# EAGLE schematic octanis_eps_mcu_shdn (EAGLE 7.1.0)
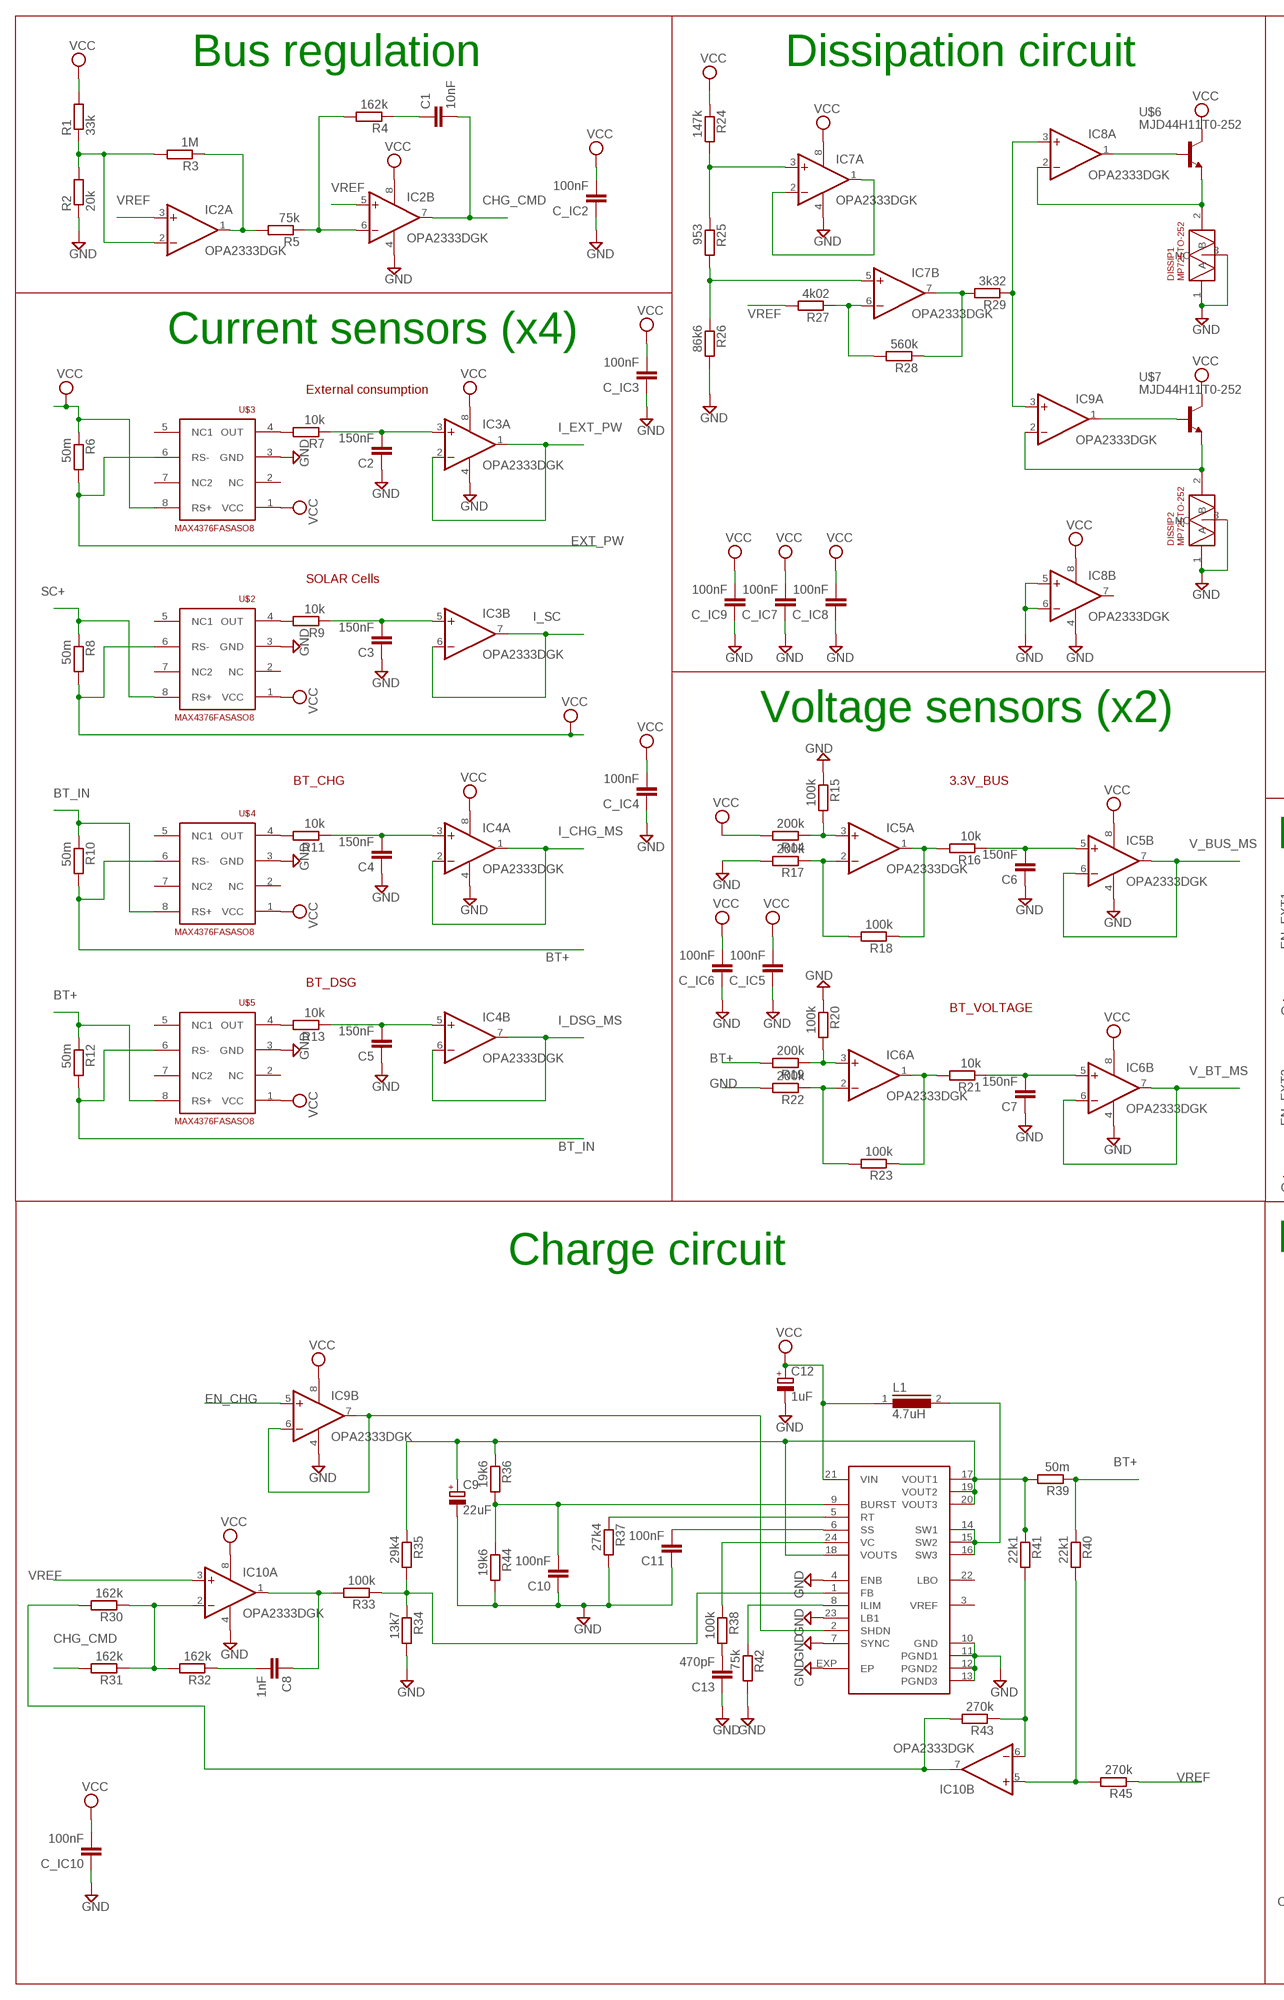
[diagram p0: schematic, sheet 1, part 1 of 2]
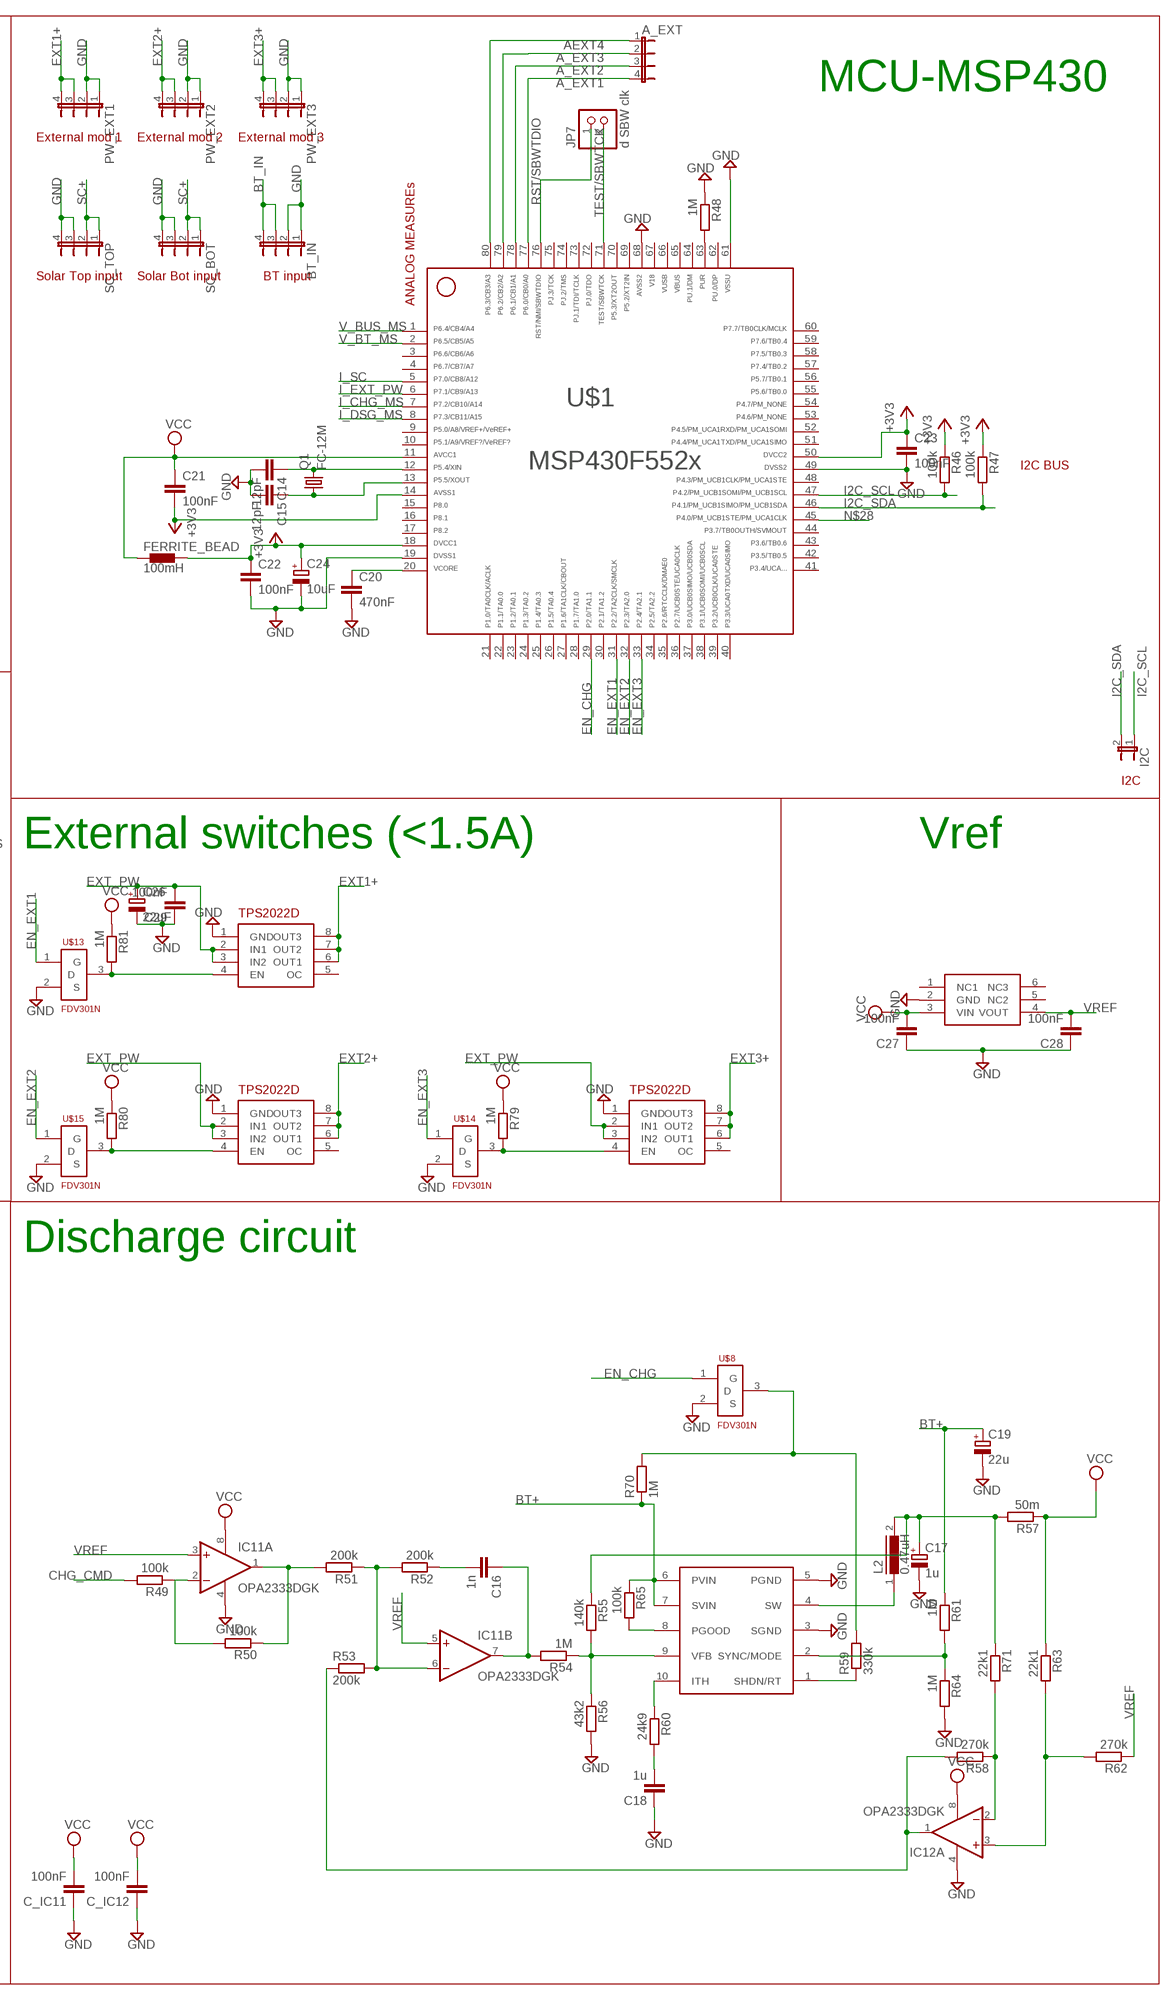
[diagram p1: schematic, sheet 1, part 2 of 2]

## Parts
A_EXT  JP4E  [JP4]
BT_IN  JP4E  [JP4]
C1  10nF  C-EUC0603  [C0603]
C2  150nF  C-EUC0603  [C0603]
C3  150nF  C-EUC0603  [C0603]
C4  150nF  C-EUC0603  [C0603]
C5  150nF  C-EUC0603  [C0603]
C6  150nF  C-EUC0603  [C0603]
C7  150nF  C-EUC0603  [C0603]
C8  1nF  C-EUC0603  [C0603]
C9  22uF  CPOL-EUA/3216-18R  [A/3216-18R]
C10  100nF  C-EUC0603  [C0603]
C11  100nF  C-EUC0603  [C0603]
C12  1uF  CPOL-EUA/3216-18R  [A/3216-18R]
C13  470pF  C-EUC0603  [C0603]
C14  12pF  C-EUC0603  [C0603]
C15  12pF  C-EUC0603  [C0603]
C16  1n  C-EUC0603  [C0603]
C17  1u  CPOL-EUA/3216-18R  [A/3216-18R]
C18  1u  C-EUC0603  [C0603]
C19  22u  CPOL-EUA/3216-18R  [A/3216-18R]
C20  470nF  C-EUC0603  [C0603]
C21  100nF  C-EUC0603  [C0603]
C22  100nF  C-EUC0603  [C0603]
C23  100nF  C-EUC0603  [C0603]
C24  10uF  CPOL-EUA/3216-18R  [A/3216-18R]
C26  22uF  CPOL-EUA/3216-18R  [A/3216-18R]
C27  100nF  C-EUC0603  [C0603]
C28  100nF  C-EUC0603  [C0603]
C29  100nF  C-EUC0603  [C0603]
C_IC2  100nF  C-EUC0603  [C0603]
C_IC3  100nF  C-EUC0603  [C0603]
C_IC4  100nF  C-EUC0603  [C0603]
C_IC5  100nF  C-EUC0603  [C0603]
C_IC6  100nF  C-EUC0603  [C0603]
C_IC7  100nF  C-EUC0603  [C0603]
C_IC8  100nF  C-EUC0603  [C0603]
C_IC9  100nF  C-EUC0603  [C0603]
C_IC10  100nF  C-EUC0603  [C0603]
C_IC11  100nF  C-EUC0603  [C0603]
C_IC12  100nF  C-EUC0603  [C0603]
DISSIP1  MP725TO-252  [TO252]
DISSIP2  MP725TO-252  [TO252]
FERRITE_BEAD  100mH  BLM15HD601SN1  [0402]
I2C  JP1E  [JP1]
IC2  OPA2333DGK  [MSOP08]
IC3  OPA2333DGK  [MSOP08]
IC4  OPA2333DGK  [MSOP08]
IC5  OPA2333DGK  [MSOP08]
IC6  OPA2333DGK  [MSOP08]
IC7  OPA2333DGK  [MSOP08]
IC8  OPA2333DGK  [MSOP08]
IC9  OPA2333DGK  [MSOP08]
IC10  OPA2333DGK  [MSOP08]
IC11  OPA2333DGK  [MSOP08]
IC12  OPA2333DGK  [MSOP08]
JP7  d SBW clk  PINHD-1X2  [1X02]
L1  4.7uH  DR73  [DR73]
L2  0.47uH  DR73  [DR73]
LTC3411  LT3411  [MSOP10]
PW_EXT1  JP4E  [JP4]
PW_EXT2  JP4E  [JP4]
PW_EXT3  JP4E  [JP4]
Q1  FC-12M  [FC-12M]
R1  33k  R-EU_R0603  [R0603]
R2  20k  R-EU_R0603  [R0603]
R3  1M  R-EU_R0603  [R0603]
R4  162k  R-EU_R0603  [R0603]
R5  75k  R-EU_R0603  [R0603]
R6  50m  R-EU_R1206  [R1206]
R7  10k  R-EU_R0603  [R0603]
R8  50m  R-EU_R1206  [R1206]
R9  10k  R-EU_R0603  [R0603]
R10  50m  R-EU_R1206  [R1206]
R11  10k  R-EU_R0603  [R0603]
R12  50m  R-EU_R1206  [R1206]
R13  10k  R-EU_R0603  [R0603]
R14  200k  R-EU_R0603  [R0603]
R15  100k  R-EU_R0603  [R0603]
R16  10k  R-EU_R0603  [R0603]
R17  200k  R-EU_R0603  [R0603]
R18  100k  R-EU_R0603  [R0603]
R19  200k  R-EU_R0603  [R0603]
R20  100k  R-EU_R0603  [R0603]
R21  10k  R-EU_R0603  [R0603]
R22  200k  R-EU_R0603  [R0603]
R23  100k  R-EU_R0603  [R0603]
R24  147k  R-EU_R0603  [R0603]
R25  953  R-EU_R0603  [R0603]
R26  86k6  R-EU_R0603  [R0603]
R27  4k02  R-EU_R0603  [R0603]
R28  560k  R-EU_R0603  [R0603]
R29  3k32  R-EU_R0603  [R0603]
R30  162k  R-EU_R0603  [R0603]
R31  162k  R-EU_R0603  [R0603]
R32  162k  R-EU_R0603  [R0603]
R33  100k  R-EU_R0603  [R0603]
R34  13k7  R-EU_R0603  [R0603]
R35  29k4  R-EU_R0603  [R0603]
R36  19k6  R-EU_R0603  [R0603]
R37  27k4  R-EU_R0603  [R0603]
R38  100k  R-EU_R0603  [R0603]
R39  50m  R-EU_R1206  [R1206]
R40  22k1  R-EU_R0603  [R0603]
R41  22k1  R-EU_R0603  [R0603]
R42  75k  R-EU_R0603  [R0603]
R43  270k  R-EU_R0603  [R0603]
R44  19k6  R-EU_R0603  [R0603]
R45  270k  R-EU_R0603  [R0603]
R46  100k  R-EU_R0603  [R0603]
R47  100k  R-EU_R0603  [R0603]
R48  1M  R-EU_R0603  [R0603]
R49  100k  R-EU_R0603  [R0603]
R50  100k  R-EU_R0603  [R0603]
R51  200k  R-EU_R0603  [R0603]
R52  200k  R-EU_R0603  [R0603]
R53  200k  R-EU_R0603  [R0603]
R54  1M  R-EU_R0603  [R0603]
R55  140k  R-EU_R0603  [R0603]
R56  43k2  R-EU_R0603  [R0603]
R57  50m  R-EU_R1206  [R1206]
R58  270k  R-EU_R0603  [R0603]
R59  330k  R-EU_R0603  [R0603]
R60  24k9  R-EU_R0603  [R0603]
R61  1M  R-EU_R0603  [R0603]
R62  270k  R-EU_R0603  [R0603]
R63  22k1  R-EU_R0603  [R0603]
R64  1M  R-EU_R0603  [R0603]
R65  100k  R-EU_R0603  [R0603]
R70  1M  R-EU_R0603  [R0603]
R71  22k1  R-EU_R0603  [R0603]
R79  1M  R-EU_R0603  [R0603]
R80  1M  R-EU_R0603  [R0603]
R81  1M  R-EU_R0603  [R0603]
SC_BOT  JP4E  [JP4]
SC_TOP  JP4E  [JP4]
U$1  F552X---PN80  [PN80]
U$2  MAX4376FASASO8  [SO8]
U$3  MAX4376FASASO8  [SO8]
U$4  MAX4376FASASO8  [SO8]
U$5  MAX4376FASASO8  [SO8]
U$6  MJD44H11T0-252  [TO252]
U$7  MJD44H11T0-252  [TO252]
U$8  FDV301N  [SOT23]
U$11  LTC3421  [QFN24]
U$13  FDV301N  [SOT23]
U$14  FDV301N  [SOT23]
U$15  FDV301N  [SOT23]
U$16  TPS2022D  [SO8]
U$17  TPS2022D  [SO8]
U$18  TPS2022D  [SO8]
U$19  ADR127B  [TSOT23-6]

## Nets
+3V3: C21.2 C22.1 C23.1 C24.+ FERRITE_BEAD.2 R46.1 R47.1 U$1.14 U$1.18 U$1.50
A_EXT1: A_EXT.4 U$1.77
A_EXT2: A_EXT.3 U$1.78
A_EXT3: A_EXT.2 U$1.79
AEXT4: A_EXT.1 U$1.80
BT+: C19.+ LTC3411.6(PVIN) LTC3411.7(SVIN) R10.2 R12.1 R19.2 R39.1 R40.1 R61.1 R65.1 R70.1 U$4.6(RS-) U$5.8(RS+)
BT_IN: BT_IN.3 BT_IN.4 R10.1 R12.2 U$4.8(RS+) U$5.6(RS-)
CHG_CMD: C1.2 IC2.7(B:OUT) R31.2 R49.2
EN_CHG: IC9.5(B:+IN) U$1.29 U$8.1(G)
EN_EXT1: U$1.31 U$13.1(G)
EN_EXT2: U$1.32 U$15.1(G)
EN_EXT3: U$1.33 U$14.1(G)
EXT1+: PW_EXT1.3 PW_EXT1.4 U$16.6(OUT1) U$16.7(OUT2) U$16.8(OUT3)
EXT2+: PW_EXT2.3 PW_EXT2.4 U$17.6(OUT1) U$17.7(OUT2) U$17.8(OUT3)
EXT3+: PW_EXT3.3 PW_EXT3.4 U$18.6(OUT1) U$18.7(OUT2) U$18.8(OUT3)
EXT_PW: C26.+ C29.2 R6.2 U$3.6(RS-) U$16.2(IN1) U$16.3(IN2) U$17.2(IN1) U$17.3(IN2) U$18.2(IN1) U$18.3(IN2)
GND: BT_IN.1 BT_IN.2 C2.1 C3.1 C4.1 C5.1 C6.1 C7.1 C9.- C10.1 C11.1 C12.- C13.1 C14.2 C15.2 C17.- C18.1 C19.- C20.2 C22.2 C23.2 C24.- C26.- C27.1 C28.1 C29.1 C_IC2.1 C_IC3.1 C_IC4.1 C_IC5.1 C_IC6.1 C_IC7.1 C_IC8.1 C_IC9.1 C_IC10.1 C_IC11.1 C_IC12.1 DISSIP1.1(A) DISSIP1.3(NC) DISSIP2.1(A) DISSIP2.3(NC) IC2.4(P:V-) IC3.4(P:V-) IC4.4(P:V-) IC5.4(P:V-) IC6.4(P:V-) IC7.4(P:V-) IC8.4(P:V-) IC8.5(B:+IN) IC8.6(B:-IN) IC9.4(P:V-) IC10.4(P:V-) IC11.4(P:V-) IC12.4(P:V-) LTC3411.3(SGND) LTC3411.5(PGND) PW_EXT1.1 PW_EXT1.2 PW_EXT2.1 PW_EXT2.2 PW_EXT3.1 PW_EXT3.2 R2.1 R15.1 R17.2 R20.1 R22.2 R26.2 R34.2 R37.2 R42.2 R44.2 R48.1 R56.2 R64.2 SC_BOT.3 SC_BOT.4 SC_TOP.3 SC_TOP.4 U$1.19 U$1.49 U$1.61 U$1.68 U$2.3(GND) U$3.3(GND) U$4.3(GND) U$5.3(GND) U$8.2(S) U$11.4(ENB) U$11.7(SYNC) U$11.10(GND) U$11.11(PGND1) U$11.12(PGND2) U$11.13(PGND3) U$11.23(LB1) U$11.EXP(EP) U$13.2(S) U$14.2(S) U$15.2(S) U$16.1(GND) U$17.1(GND) U$18.1(GND) U$19.2(GND)
I2C_SCL: I2C.1 R46.2 U$1.47
I2C_SDA: I2C.2 R47.2 U$1.46
I_CHG_MS: IC4.1(A:OUT) IC4.2(A:-IN) U$1.7
I_DSG_MS: IC4.6(B:-IN) IC4.7(B:OUT) U$1.8
I_EXT_PW: IC3.1(A:OUT) IC3.2(A:-IN) U$1.6
I_SC: IC3.6(B:-IN) IC3.7(B:OUT) U$1.5
N$1: IC2.2(A:-IN) R1.1 R2.2 R3.2
N$2: IC2.1(A:OUT) R3.1 R5.2
N$3: C1.1 R4.1
N$4: IC2.6(B:-IN) R4.2 R5.1
N$5: C4.2 IC4.3(A:+IN) R11.1
N$6: C2.2 IC3.3(A:+IN) R7.1
N$7: C3.2 IC3.5(B:+IN) R9.1
N$8: C5.2 IC4.5(B:+IN) R13.1
N$9: C7.2 IC6.5(B:+IN) R21.1
N$10: IC6.1(A:OUT) R21.2 R23.1
N$11: C6.2 IC5.5(B:+IN) R16.1
N$12: IC5.1(A:OUT) R16.2 R18.1
N$13: IC5.2(A:-IN) R17.1 R18.2
N$14: IC5.3(A:+IN) R14.1 R15.2
N$15: IC6.2(A:-IN) R22.1 R23.2
N$16: IC6.3(A:+IN) R19.1 R20.2
N$17: IC7.1(A:OUT) IC7.2(A:-IN)
N$18: IC7.3(A:+IN) R24.2 R25.1
N$19: IC7.5(B:+IN) R25.2 R26.1
N$20: IC7.6(B:-IN) R27.1 R28.2
N$21: IC7.7(B:OUT) R28.1 R29.2
N$22: IC8.3(A:+IN) IC9.3(A:+IN) R29.1
N$23: IC10.2(A:-IN) R30.1 R31.1 R32.2
N$24: C8.2 R32.1
N$25: C8.1 IC10.1(A:OUT) R33.2
N$26: R33.1 R34.1 R35.2 U$11.1(FB)
N$27: R48.2 U$1.63
N$28: U$1.45
N$29: R42.1 U$11.8(ILIM)
N$30: C10.2 R36.2 R44.1 U$11.9(BURST)
N$31: C13.2 R38.2
N$32: R37.1 U$11.5(RT)
N$33: C11.2 U$11.6(SS)
N$34: R80.2 U$15.3(D) U$17.4(EN)
N$35: C18.2 R60.2
N$36: R38.1 U$11.24(VC)
N$37: IC9.6(B:-IN) IC9.7(B:OUT) U$11.2(SHDN)
N$38: IC10.5(B:+IN) R40.2 R45.2
N$39: IC10.6(B:-IN) R41.2 R43.1
N$40: R9.2 U$2.4(OUT)
N$41: R11.2 U$4.4(OUT)
N$42: R7.2 U$3.4(OUT)
N$43: R13.2 U$5.4(OUT)
N$44: IC8.1(A:OUT) U$6.1(B)
N$45: IC9.1(A:OUT) U$7.1(B)
N$46: DISSIP2.2(B) IC9.2(A:-IN) U$7.3(E)
N$47: DISSIP1.2(B) IC8.2(A:-IN) U$6.3(E)
N$48: C14.1 Q1.2 U$1.12
N$49: C20.1 U$1.20
N$50: C15.1 Q1.1 U$1.13
N$51: C16.1 IC11.7(B:OUT) R54.2
N$52: IC11.2(A:-IN) R49.1 R50.2
N$53: IC11.1(A:OUT) R50.1 R51.2
N$54: IC11.6(B:-IN) R51.1 R52.2 R53.2
N$55: C16.2 R52.1
N$56: IC12.1(A:OUT) R53.1 R58.2
N$57: LTC3411.9(VFB) R54.1 R55.2 R56.1
N$58: C17.+ L2.2 R55.1 R57.2 R71.1
N$59: LTC3411.10(ITH) R60.1
N$60: LTC3411.2(SYNC/MODE) R61.2 R64.1
N$61: IC12.2(A:-IN) R58.1 R71.2
N$62: LTC3411.1(SHDN/RT) R59.1
N$63: IC12.3(A:+IN) R62.2 R63.2
N$64: LTC3411.8(PGOOD) R65.2
N$65: R59.2 R70.2 U$8.3(D)
N$75: C9.+ R35.1 R36.1 R39.2 R41.1 U$11.17(VOUT1) U$11.18(VOUTS) U$11.19(VOUT2) U$11.20(VOUT3)
N$77: L2.1 LTC3411.4(SW)
N$78: L1.2 U$11.14(SW1) U$11.15(SW2) U$11.16(SW3)
N$79: R81.2 U$13.3(D) U$16.4(EN)
N$80: R79.2 U$14.3(D) U$18.4(EN)
RST/SBWTDIO: JP7.1 U$1.76
SC+: R8.1 SC_BOT.1 SC_BOT.2 SC_TOP.1 SC_TOP.2 U$2.8(RS+)
TEST/SBWTCK: JP7.2 U$1.71
UUU: IC10.7(B:OUT) R30.2 R43.2
V_BT_MS: IC6.6(B:-IN) IC6.7(B:OUT) U$1.2
V_BUS_MS: IC5.6(B:-IN) IC5.7(B:OUT) U$1.1
VCC: C12.+ C21.1 C27.2 C_IC2.2 C_IC3.2 C_IC4.2 C_IC5.2 C_IC6.2 C_IC7.2 C_IC8.2 C_IC9.2 C_IC10.2 C_IC11.2 C_IC12.2 FERRITE_BEAD.1 IC2.8(P:V+) IC3.8(P:V+) IC4.8(P:V+) IC5.8(P:V+) IC6.8(P:V+) IC7.8(P:V+) IC8.8(P:V+) IC9.8(P:V+) IC10.8(P:V+) IC11.8(P:V+) IC12.8(P:V+) L1.1 R1.2 R6.1 R8.2 R14.2 R24.1 R57.1 R63.1 R79.1 R80.1 R81.1 U$1.11 U$2.1(VCC) U$2.6(RS-) U$3.1(VCC) U$3.8(RS+) U$4.1(VCC) U$5.1(VCC) U$6.2(C) U$7.2(C) U$11.21(VIN) U$19.3(VIN)
VREF: C28.2 IC2.3(A:+IN) IC2.5(B:+IN) IC10.3(A:+IN) IC11.3(A:+IN) IC11.5(B:+IN) R27.2 R45.1 R62.1 U$19.4(VOUT)
Unconnected: IC8.7(B:OUT) IC12.5(B:+IN) IC12.6(B:-IN) IC12.7(B:OUT) U$1.3 U$1.4 U$1.9 U$1.10 U$1.15 U$1.16 U$1.17 U$1.21 U$1.22 U$1.23 U$1.24 U$1.25 U$1.26 U$1.27 U$1.28 U$1.30 U$1.34 U$1.35 U$1.36 U$1.37 U$1.38 U$1.39 U$1.40 U$1.41 U$1.42 U$1.43 U$1.44 U$1.48 U$1.51 U$1.52 U$1.53 U$1.54 U$1.55 U$1.56 U$1.57 U$1.58 U$1.59 U$1.60 U$1.62 U$1.64 U$1.69 U$1.70 U$1.72 U$1.73 U$1.74 U$1.75 U$2.2(NC) U$2.5(NC1) U$2.7(NC2) U$3.2(NC) U$3.5(NC1) U$3.7(NC2) U$4.2(NC) U$4.5(NC1) U$4.7(NC2) U$5.2(NC) U$5.5(NC1) U$5.7(NC2) U$11.3(VREF) U$11.22(LBO) U$16.5(OC) U$17.5(OC) U$18.5(OC) U$19.1(NC1) U$19.5(NC2) U$19.6(NC3)

## Notes on the sheet
- Bus regulation | Dissipation circuit
- MCU-MSP430
- External mod 1 | External mod 2 | External mod 3
- Solar Top input | Solar Bot input | BT input
- ANALOG MEASUREs
- Current sensors (x4)
- External consumption
- I2C BUS
- SOLAR Cells
- Voltage sensors (x2)
- BT_CHG | 3.3V_BUS | I2C
- External switches (<1.5A) | Vref
- BT_DSG
- BT_VOLTAGE
- Charge circuit | Discharge circuit

## Power pins joined to a net without a drawn wire
65: U$1.65
66: U$1.66
67: U$1.67

## Library data of the parts
A_EXT BT_IN PW_EXT1-PW_EXT3 SC_BOT SC_TOP = jumper:JP4E: JUMPER
C1-C8 C10 C11 C13-C16 C18 C20-C23 C27-C29 C_IC2-C_IC12 = rcl:C-EU: CAPACITOR, European symbol
C9 C12 C17 C19 C24 C26 = rcl:CPOL-EU: POLARIZED CAPACITOR, European symbol
DISSIP1 DISSIP2 = Octanis1_EPS:MP725
FERRITE_BEAD = inductors:BLM15H: EMIFIL (R) Chip Ferrite Bead for GHz Noise Source: http://www.murata.com/ Ferrite Bead BLM15H.pdf
I2C = jumper:JP1E: JUMPER
IC2-IC12 = linear:OPA2333: DUAL 1.8V, microPOWER CMOS OPERATIONAL AMPLIFIERS Zerø-Drift Series Source: Texas Instruments (Burr-Brown) .. U11 opa333 Operational Amp.pdf
JP7 = pinhead:PINHD-1X2: PIN HEADER
L1 L2 = inductors:DR73: High Power Density, High Efficiency, Shielded Inductors Source: coiltronics_dr_series.pdf
LTC3411 = Octanis1_EPS:LT3411: LINEAR TECHNOLOGY - LTC3411AEMS#PBF - CONV. BUCK SYNCH 1.25A 4MHZ 10MSOP
Q1 = crystal:FC-12M: kHz RANGE CRYSTAL UNIT LOW PROFILE SMD Source: Epson Toyocom FC-12M.pdf
R1-R65 R70 R71 R79-R81 = rcl:R-EU_: RESISTOR, European symbol
U$1 = TI_MSP430_v16:F552X---PN80: ***MSP430F552X***PN80 http://www.ti.com/lit/gpn/msp430f5529 Rev1.0 06/2010 For F552X where X is 1,5,7,9
U$2-U$5 = Octanis1_EPS:MAX4376FASA: MAX4376/MAX4377/ MAX4378 Single/Dual/Quad, High-Side Current-Sense Amplifiers with Internal Gain
U$6 U$7 = Octanis1_EPS:MJD44H11: MJD44H11, MJD45H11 Complementary power transistors
U$8 U$13-U$15 = Octanis1_EPS:FDV301N: FDV301N Digital FET ,N-Channel
U$11 = Octanis1_EPS:LTC3421: 3A, 3MHz Micropower Synchronous Boost Converter with Output Disconnect
U$16-U$18 = Octanis1_EPS:TPS2022D: TEXAS INSTRUMENTS - TPS2022D - IC, 1.5A PWR DIST SWITCH 8SOIC
U$19 = Octanis1_EPS:ADR127B: ANALOG DEVICES - ADR127BUJZ-REEL7 - VOLTAGE REFERENCE, SERIES, 3.3V, TSOT-6

## Net classes
0 default: clearance 0.205 mm